# EAGLE design octanis_v0.1 (EAGLE 7.2.0)
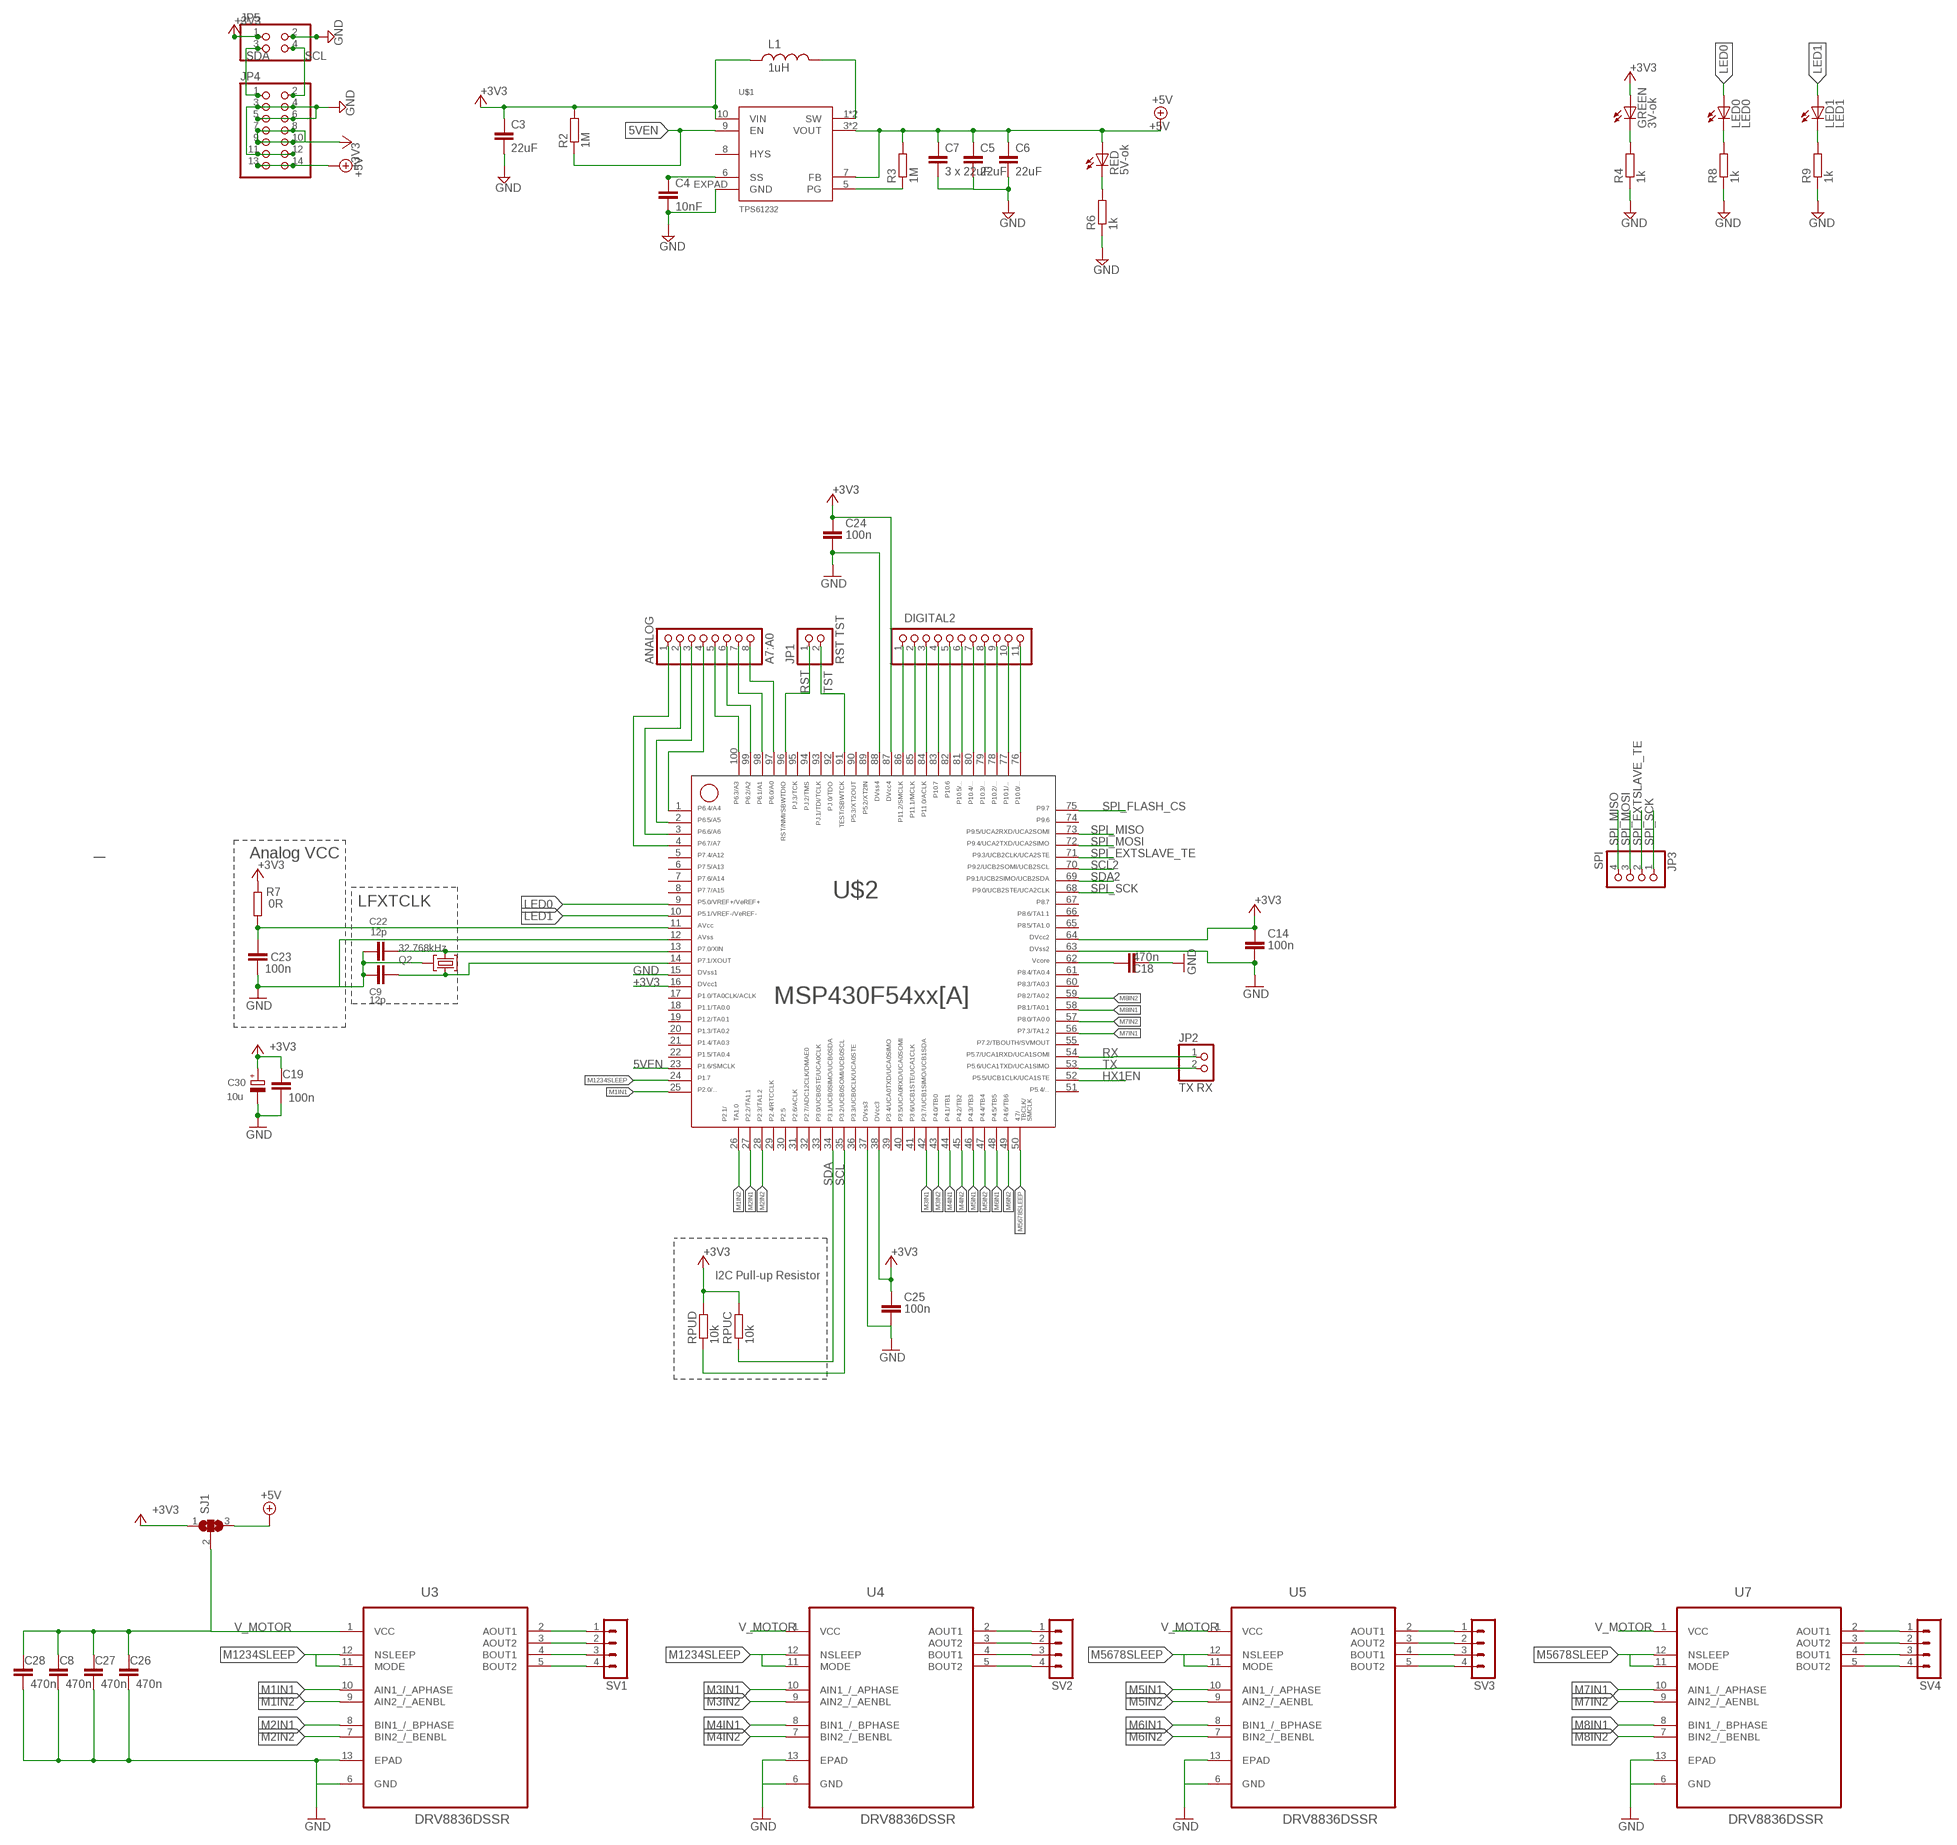
[diagram p0: schematic, sheet 1, part 1 of 2]
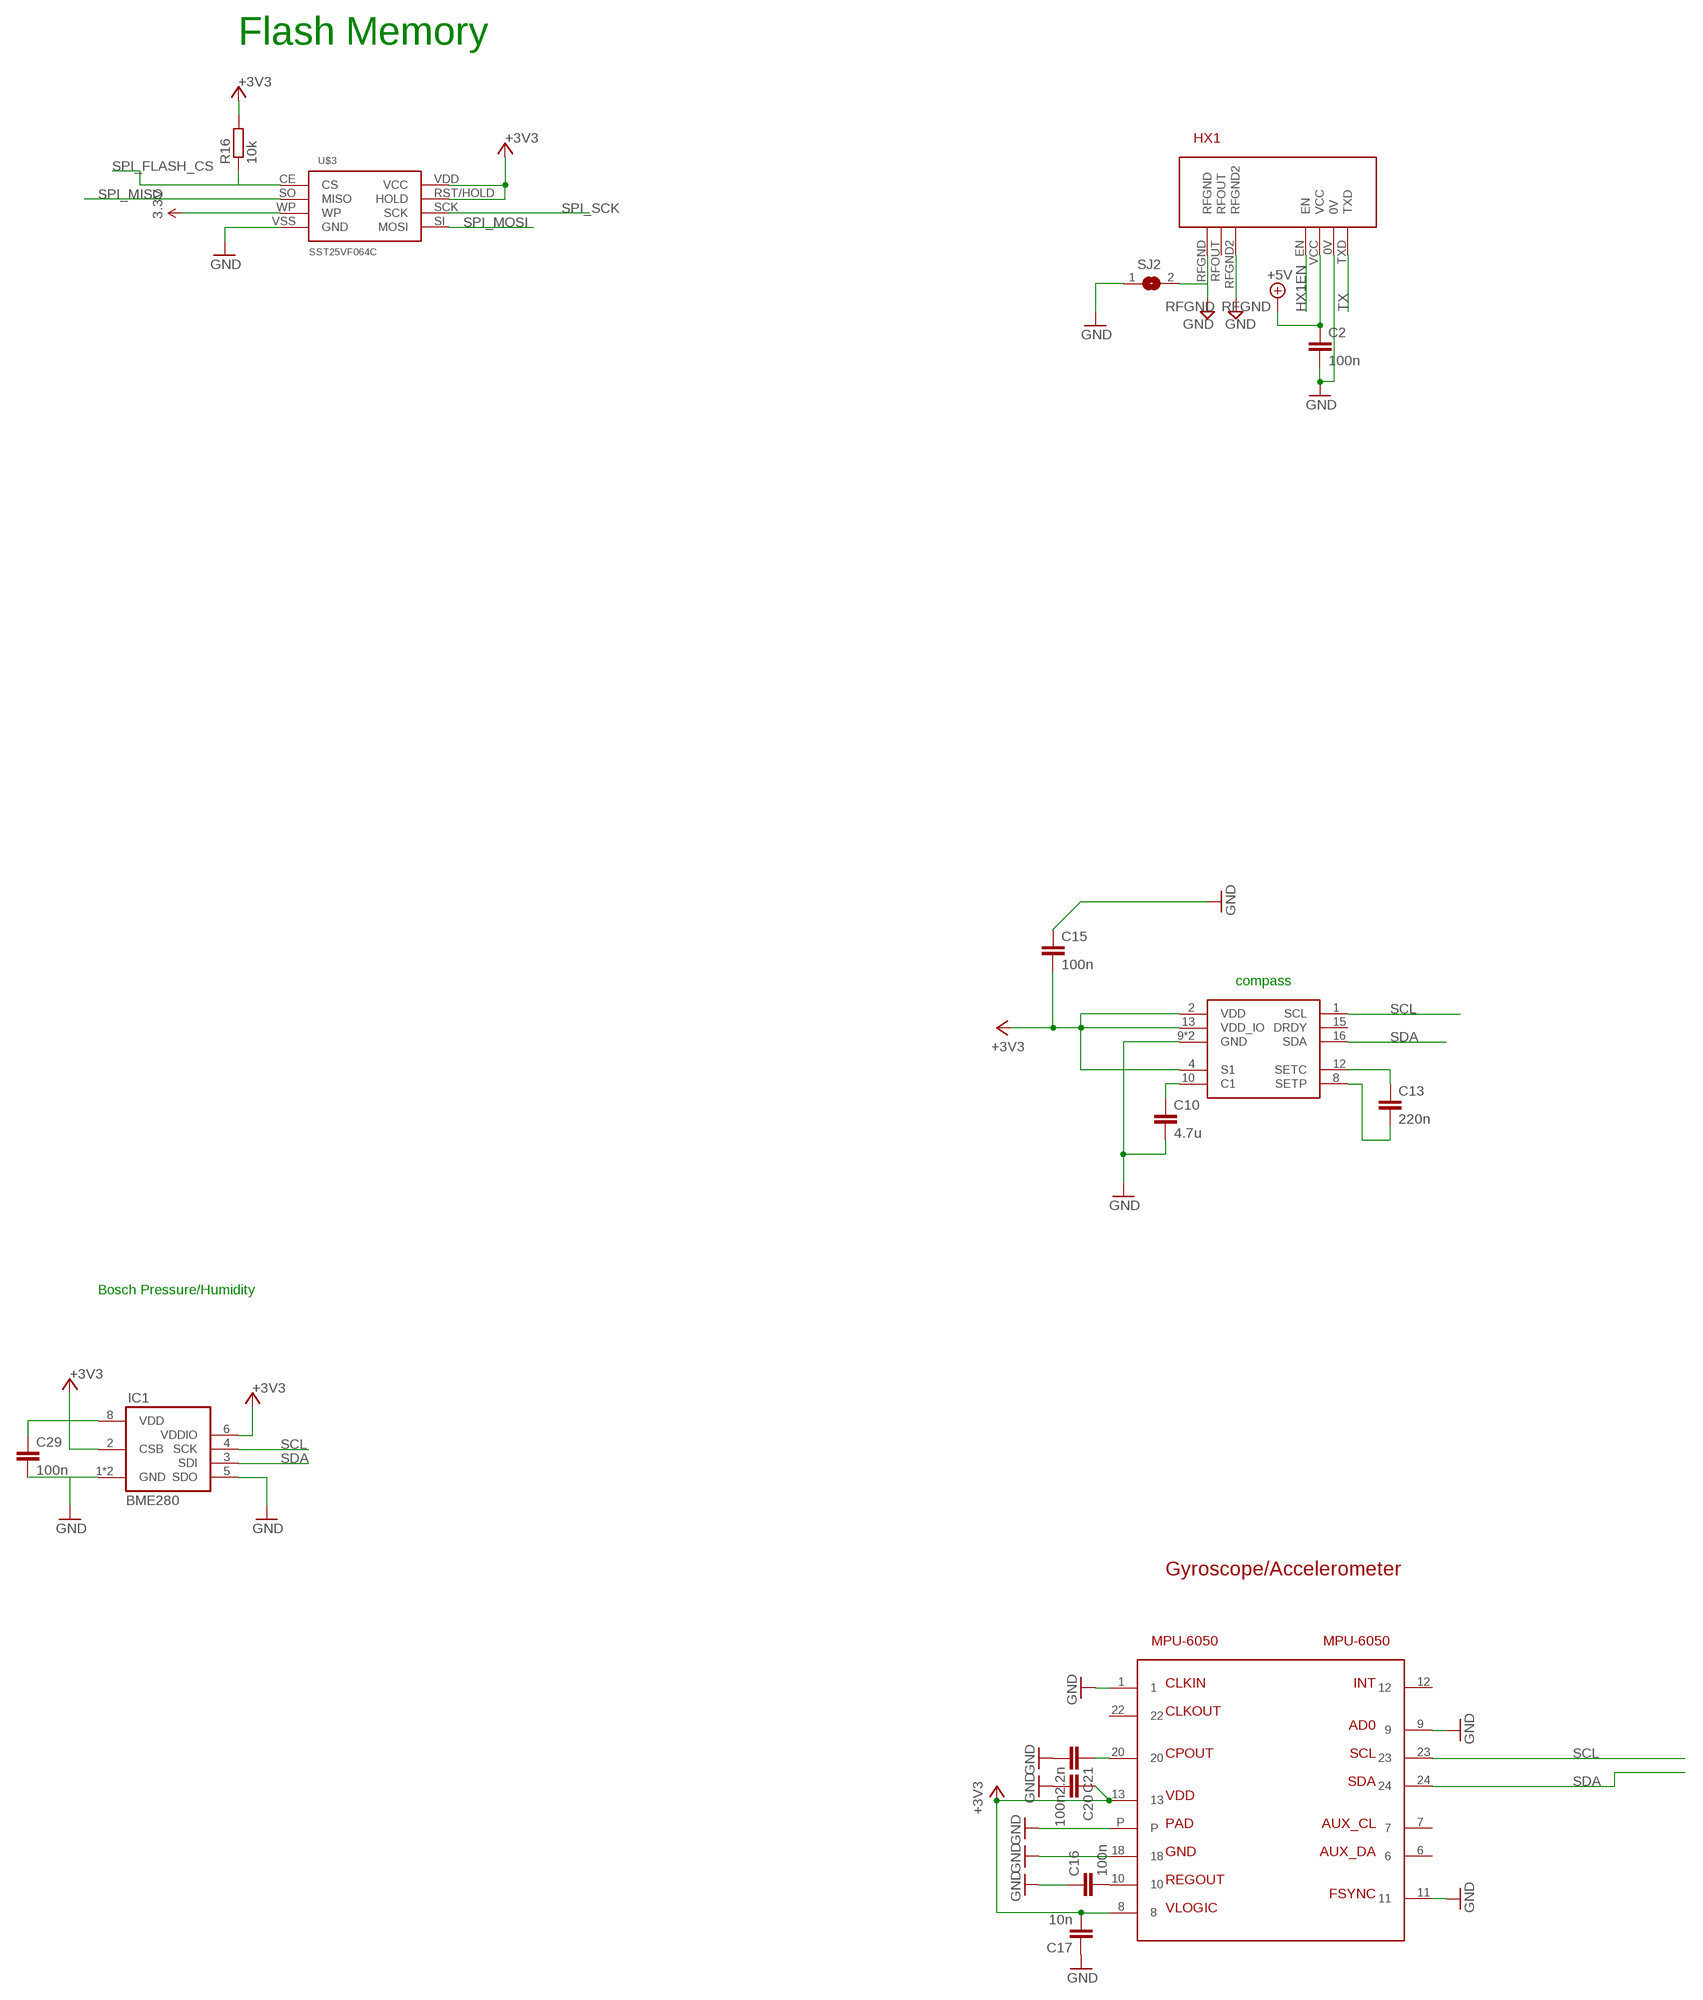
[diagram p1: schematic, sheet 1, part 2 of 2]

## Parts
ANALOG  A7:A0  PINHD-1X8  [1X08]
C2  100n  C-EUC0603  [C0603]
C3  22uF  C-EUC0603  [C0603]
C4  10nF  C-EUC0603  [C0603]
C5  22uF  C-EUC0603  [C0603]
C6  22uF  C-EUC0603  [C0603]
C7  3 x 22uF  C-EUC0603  [C0603]
C8  470n  C-EUC0603  [C0603]
C9  12p  C-EUC0402  [C0402]
C10  4.7u  C-EUC0603  [C0603]
C13  220n  C-EUC0603  [C0603]
C14  100n  C-EUC0603  [C0603]
C15  100n  C-EUC0603  [C0603]
C16  100n  C-EUC0603  [C0603]
C17  10n  C-EUC0603  [C0603]
C18  470n  C-EUC0603  [C0603]
C19  100n  C-EUC0603  [C0603]
C20  100n  C-EUC0603  [C0603]
C21  2.2n  C-EUC0603  [C0603]
C22  12p  C-EUC0402  [C0402]
C23  100n  C-EUC0402  [C0402]
C24  100n  C-EUC0603  [C0603]
C25  100n  C-EUC0603  [C0603]
C26  470n  C-EUC0603  [C0603]
C27  470n  C-EUC0603  [C0603]
C28  470n  C-EUC0603  [C0603]
C29  100n  C-EUC0603  [C0603]
C30  10u  CPOL-EUA/3216-18R  [A/3216-18R]
COMPASS  HMC5883L  HMC5883L  [LPCC16]
DIGITAL2  DIGITAL I/O  PINHD-1X11  [1X11]
GREEN  3V-ok  LEDCHIPLED_0603  [CHIPLED_0603]
IC1  BME280  [BME280]
JP1  RST TST  PINHD-1X2  [1X02]
JP2  TX RX  PINHD-1X2  [1X02]
JP3  SPI  PINHD-1X4  [1X04]
JP4  PINHD-2X7  [2X07]
JP5  PINHD-2X2  [2X02]
L1  1uH  XFL4020  [XFL4020]
LED0  LED0  LEDCHIPLED_0603  [CHIPLED_0603]
LED1  LED1  LEDCHIPLED_0603  [CHIPLED_0603]
MPU-6050  MPU-6050  [QFN24]
Q2  32.768kHz  MS3V-T1R  [MS3V-T1R]
R2  1M  R-EU_R0603  [R0603]
R3  1M  R-EU_R0603  [R0603]
R4  1k  R-EU_R0603  [R0603]
R6  1k  R-EU_R0603  [R0603]
R7  0R  R-EU_R0402  [R0402]
R8  1k  R-EU_R0603  [R0603]
R9  1k  R-EU_R0603  [R0603]
R16  10k  R-EU_R0603  [R0603]
RED  5V-ok  LEDCHIPLED_0603  [CHIPLED_0603]
RPUC  10k  R-EU_R0603  [R0603]
RPUD  10k  R-EU_R0603  [R0603]
SJ1  SJ2W  [SJ_2]
SJ2  SJ  [SJ]
SV1  MA04-1  [MA04-1]
SV2  MA04-1  [MA04-1]
SV3  MA04-1  [MA04-1]
SV4  MA04-1  [MA04-1]
U3  DRV8836DSSR  [SON50P200X300X80-13N]
U4  DRV8836DSSR  [SON50P200X300X80-13N]
U5  DRV8836DSSR  [SON50P200X300X80-13N]
U7  DRV8836DSSR  [SON50P200X300X80-13N]
U$1  TPS61232  [S-PVSON-N10]
U$2  MSP430F5438A  F54XX[A]---PZ100  [PZ100]
U$3  SST25VF064C  [SOIC_8-LEAD]
U$4  HX1  [HX1]

## Nets
3.3V [power]: U$3.WP
5VEN: R2.1 U$1.9(EN) U$2.23
+3V3 [power]: C3.1 C14.1 C15.2 C17.2 C19.2 C20.1 C24.1 C25.1 C29.1 C30.+ COMPASS.2(VDD) COMPASS.4(S1) COMPASS.13(VDD_IO) GREEN.A IC1.2(CSB) IC1.6(VDDIO) IC1.8(VDD) JP4.7 JP4.8 JP4.9 JP4.10 JP5.1 L1.P$1 MPU-6050.8 MPU-6050.13 R2.2 R7.2 R16.2 RPUC.2 RPUD.2 SJ1.1 U$1.10(VIN) U$2.16 U$2.38 U$2.64 U$2.87 U$3.RST/HOLD(HOLD) U$3.VDD(VCC)
+5V [fine]: C2.1 C5.1 C6.1 C7.1 JP4.13 JP4.14 R3.2 RED.A SJ1.3 U$1.3(VOUT) U$1.4(VOUT) U$1.7(FB) U$4.VCC
AVCC1 [VIN]: C23.1 R7.1 U$2.11
GND [power]: C2.2 C3.2 C4.2 C5.2 C6.2 C7.2 C8.1 C9.1 C10.2 C14.2 C15.1 C16.1 C17.1 C18.1 C19.1 C20.2 C21.2 C22.1 C23.2 C24.2 C25.2 C26.1 C27.1 C28.1 C29.2 C30.- COMPASS.9(GND) COMPASS.11(GND) IC1.1(GND) IC1.5(SDO) IC1.7(GND) JP4.3 JP4.4 JP4.5 JP4.6 JP4.11 JP4.12 JP5.2 MPU-6050.1 MPU-6050.9 MPU-6050.11 MPU-6050.18 MPU-6050.P Q2.P3(GND) R4.1 R6.1 R8.1 R9.1 SJ2.1 U3.6(GND) U3.13(EPAD) U4.6(GND) U4.13(EPAD) U5.6(GND) U5.13(EPAD) U7.6(GND) U7.13(EPAD) U$1.EXPAD(GND) U$2.12 U$2.15 U$2.37 U$2.63 U$2.88 U$3.VSS(GND) U$4.0V
HX1EN: U$2.52 U$4.EN
IND: L1.P$2 U$1.1(SW) U$1.2(SW)
LED0: LED0.A U$2.9
LED1: LED1.A U$2.10
M1IN1: U3.10(AIN1_/_APHASE) U$2.25
M1IN2: U3.9(AIN2_/_AENBL) U$2.26
M2IN1: U3.8(BIN1_/_BPHASE) U$2.27
M2IN2: U3.7(BIN2_/_BENBL) U$2.28
M3IN1: U4.10(AIN1_/_APHASE) U$2.42
M3IN2: U4.9(AIN2_/_AENBL) U$2.43
M4IN1: U4.8(BIN1_/_BPHASE) U$2.44
M4IN2: U4.7(BIN2_/_BENBL) U$2.45
M5IN1: U5.10(AIN1_/_APHASE) U$2.46
M5IN2: U5.9(AIN2_/_AENBL) U$2.47
M6IN1: U5.8(BIN1_/_BPHASE) U$2.48
M6IN2: U5.7(BIN2_/_BENBL) U$2.49
M7IN1: U7.10(AIN1_/_APHASE) U$2.56
M7IN2: U7.9(AIN2_/_AENBL) U$2.57
M8IN1: U7.8(BIN1_/_BPHASE) U$2.58
M8IN2: U7.7(BIN2_/_BENBL) U$2.59
M1234SLEEP: U3.11(MODE) U3.12(NSLEEP) U4.11(MODE) U4.12(NSLEEP) U$2.24
M5678SLEEP: U5.11(MODE) U5.12(NSLEEP) U7.11(MODE) U7.12(NSLEEP) U$2.50
N$2: R3.1 U$1.5(PG)
N$4: GREEN.C R4.2
N$5: LED0.C R8.2
N$6: LED1.C R9.2
N$13: SV2.1 U4.2(AOUT1)
N$14: DIGITAL2.1 U$2.86
N$15: DIGITAL2.2 U$2.85
N$17: C10.1 COMPASS.10(C1)
N$18: C16.2 MPU-6050.10
N$19: C21.1 MPU-6050.20
N$20: DIGITAL2.3 U$2.84
N$21: DIGITAL2.4 U$2.83
N$22: DIGITAL2.5 U$2.82
N$23: DIGITAL2.6 U$2.81
N$24: DIGITAL2.7 U$2.80
N$25: C13.2 COMPASS.8(SETP)
N$26: DIGITAL2.8 U$2.79
N$27: ANALOG.8 U$2.97
N$28: ANALOG.7 U$2.98
N$30: ANALOG.6 U$2.99
N$31: DIGITAL2.9 U$2.78
N$32: C13.1 COMPASS.12(SETC)
N$39: SV2.2 U4.3(AOUT2)
N$40: SV2.3 U4.4(BOUT1)
N$41: SV2.4 U4.5(BOUT2)
N$42: C4.1 U$1.6(SS)
N$44: R6.2 RED.C
N$45: SV3.1 U5.2(AOUT1)
N$46: SV3.2 U5.3(AOUT2)
N$47: SV3.3 U5.4(BOUT1)
N$48: SV3.4 U5.5(BOUT2)
N$49: SV1.1 U3.2(AOUT1)
N$50: SV1.2 U3.3(AOUT2)
N$51: SV1.3 U3.4(BOUT1)
N$52: SV1.4 U3.5(BOUT2)
N$53: SV4.1 U7.2(AOUT1)
N$54: SV4.2 U7.3(AOUT2)
N$55: SV4.3 U7.4(BOUT1)
N$56: SV4.4 U7.5(BOUT2)
N$73: ANALOG.5 U$2.100
N$74: ANALOG.4 U$2.1
N$75: ANALOG.3 U$2.2
N$76: ANALOG.2 U$2.3
N$77: ANALOG.1 U$2.4
N$78: DIGITAL2.10 U$2.77
N$79: DIGITAL2.11 U$2.76
P5.4/XIN1: C22.2 Q2.P2 U$2.13
P5.5/XOUT1: C9.2 Q2.P1 U$2.14
RFGND [power]: SJ2.2 U$4.RFGND U$4.RFGND2 ; supply symbol labelled GND
RST: JP1.1 U$2.96
RX: JP2.1 U$2.54
SCL: COMPASS.1(SCL) IC1.4(SCK) JP4.2 JP5.4 MPU-6050.23 RPUD.1 U$2.35
SCL2: U$2.70
SDA: COMPASS.16(SDA) IC1.3(SDI) JP4.1 JP5.3 MPU-6050.24 RPUC.1 U$2.34
SDA2: U$2.69
SPI_EXTSLAVE_TE: JP3.2 U$2.71
SPI_FLASH_CS: R16.1 U$2.75 U$3.CE(CS)
SPI_MISO: JP3.4 U$2.73 U$3.SO(MISO)
SPI_MOSI: JP3.3 U$2.72 U$3.SI(MOSI)
SPI_SCK: JP3.1 U$2.68 U$3.SCK
TST: JP1.2 U$2.91
TX: JP2.2 U$2.53 U$4.TXD
V_MOTOR [fine]: C8.2 C26.2 C27.2 C28.2 SJ1.2 U3.1(VCC) U4.1(VCC) U5.1(VCC) U7.1(VCC)
VCORE [VIN]: C18.2 U$2.62
Unconnected: COMPASS.15(DRDY) MPU-6050.6 MPU-6050.7 MPU-6050.12 MPU-6050.22 U$1.8(HYS) U$2.5 U$2.6 U$2.7 U$2.8 U$2.17 U$2.18 U$2.19 U$2.20 U$2.21 U$2.22 U$2.29 U$2.30 U$2.31 U$2.32 U$2.33 U$2.36 U$2.39 U$2.40 U$2.41 U$2.51 U$2.55 U$2.60 U$2.61 U$2.65 U$2.66 U$2.67 U$2.74 U$2.89 U$2.90 U$2.92 U$2.93 U$2.94 U$2.95 U$4.RFOUT

## Notes on the sheet
- Flash Memory
- compass
- Analog VCC
- LFXTCLK
- Bosch Pressure/Humidity
- I2C Pull-up Resistor
- Gyroscope/Accelerometer

## Library data of the parts
ANALOG = pinhead:PINHD-1X8: PIN HEADER
C2-C10 C13-C29 = rcl:C-EU: CAPACITOR, European symbol
C30 = rcl:CPOL-EU: POLARIZED CAPACITOR, European symbol
COMPASS = HMC5883L:HMC5883L
DIGITAL2 = pinhead:PINHD-1X11: PIN HEADER
GREEN LED0 LED1 RED = adafruit:LED: LED OSRAM: - CHIPLED LG R971, LG N971, LY N971, LG Q971, LY Q971, LO R971, LY R971 LH N974, LH R974 LS Q976, LO Q976, LY Q976 LO Q996 - Hyper CHIPLED LW Q18S LB Q993, LB Q99A, LB R99A - SideLED LS A670, LO A670, LY A670, LG A670, LP A670 LB A673, LV A673, LT A673, LW A673 LH A674 LY A675 LS A676, LA A676, LO A676, LY A676, LW A676 LS A679, LY A679, LG A679 - Hyper Micro SIDELED® LS Y876, LA Y876, LO Y876, LY Y876 LT Y87S - SmartLED LW L88C, LW L88S LB L89C, LB L89S, LG L890 LS L89K, LO L89K, LY L89K LS L896, LA L896, LO L896, LY L896 - TOPLED LS T670, LO T670, LY T670, LG T670, LP T670 LSG T670, LSP T670, LSY T670, LOP T670, LYG T670 LG T671, LOG T671, LSG T671 LB T673, LV T673, LT T673, LW T673 LH T674 LS T676, LA T676, LO T676, LY T676, LB T676, LH T676, LSB T676, LW T676 LB T67C, LV T67C, LT T67C, LS T67K, LO T67K, LY T67K, LW E67C LS E67B, LA E67B, LO E67B, LY E67B, LB E67C, LV E67C, LT E67C LW T67C LS T679, LY T679, LG T679 LS T770, LO T770, LY T770, LG T770, LP T770 LB T773, LV T773, LT T773, LW T773 LH T774 LS E675, LA E675, LY E675, LS T675 LS T776, LA T776, LO T776, LY T776, LB T776 LHGB T686 LT T68C, LB T68C - Hyper Mini TOPLED® LB M676 - Mini TOPLED Santana® LG M470 LS M47K, LO M47K, LY M47K Source: http://www.osram.convergy.de/
IC1 = bosch-bme280:BME280: DIGITAL HUMIDITY, PRESSURE AND TEMPERATURE SENSOR * Digital interface I²C (up to 3.4 MHz) and SPI (3 and 4 wire, up to 10 MHz)* Supply voltage VDD main supply voltage range: 1.71 V to 3.6 V*VDDIO interface voltage range: 1.2 V to 3.6 V Operating range -40…+85 °C, 0…100 % rel. humidity, 300…1100 hPa The library has been designed by Richard Magdycz <https://www.facebook.com/groups/eaglecadsoftUK>
JP1 JP2 = pinhead:PINHD-1X2: PIN HEADER
JP3 = pinhead:PINHD-1X4: PIN HEADER
JP4 = pinhead:PINHD-2X7: PIN HEADER
JP5 = pinhead:PINHD-2X2: PIN HEADER
L1 = Coilcraft:XFL4020
MPU-6050 = seb:MPU-6050
Q2 = microcrystal:MS3V-T1R
R2-R4 R6-R9 R16 RPUC RPUD = rcl:R-EU_: RESISTOR, European symbol
SJ1 = jumper:SJ2W: SMD solder JUMPER
SJ2 = jumper:SJ: SMD solder JUMPER
SV1-SV4 = con-lstb:MA04-1: PIN HEADER; OC_FARNELL: unknown; OC_NEWARK: unknown
U3-U5 U7 = DRV8834:DRV8836DSSR: DUAL LOW VOLTAGE H-BRIDGE IC,SON-12; MPN: DRV8836DSSR; OC_FARNELL: 2115236; OC_NEWARK: 94T6066; PACKAGE: SON-12; SUPPLIER: TEXAS INSTRUMENTS
U$1 = texasinstruments:TPS61232: Up to 96% Efficiency Synchronous Boost Converter 3.3 V to 5 V Power Conversion with 2.1 A Output Current Input Supply Voltage Supervisor with Adjustable Threshold/ Hysteresis Power Save Mode for Light Load Efficiency Load Disconnect During Shutdown Output Over Voltage Protection Programmable Soft Start Power Good Output Input Voltage Range: 2.3 V to 5.5 V Output Voltage Range: 2.5 V to 5.5 V 2 MHz Switching Frequency Output Capacitor Discharge (TPS61231) 3 mm × 3 mm × 0.9 mm SON Package
U$2 = TI_MSP430_v16:F54XX[A]---PZ100: ***MSP430F54xx***PZ100
U$3 = BertaLib:SST25VF064C
U$4 = Octanis1:HX1: Radiometrix HX1: VHF Narrow Band FM 300mW Transmitter. HX1-144.390-3

## Net classes
0 default: width 0.305 mm
1 power: width 0.203 mm, drill 0.305 mm, clearance 0.152 mm
2 VIN: width 0.203 mm, drill 0.305 mm, clearance 0.152 mm
3 fine: width 0.406 mm, drill 0.61 mm, clearance 0.152 mm

## Board
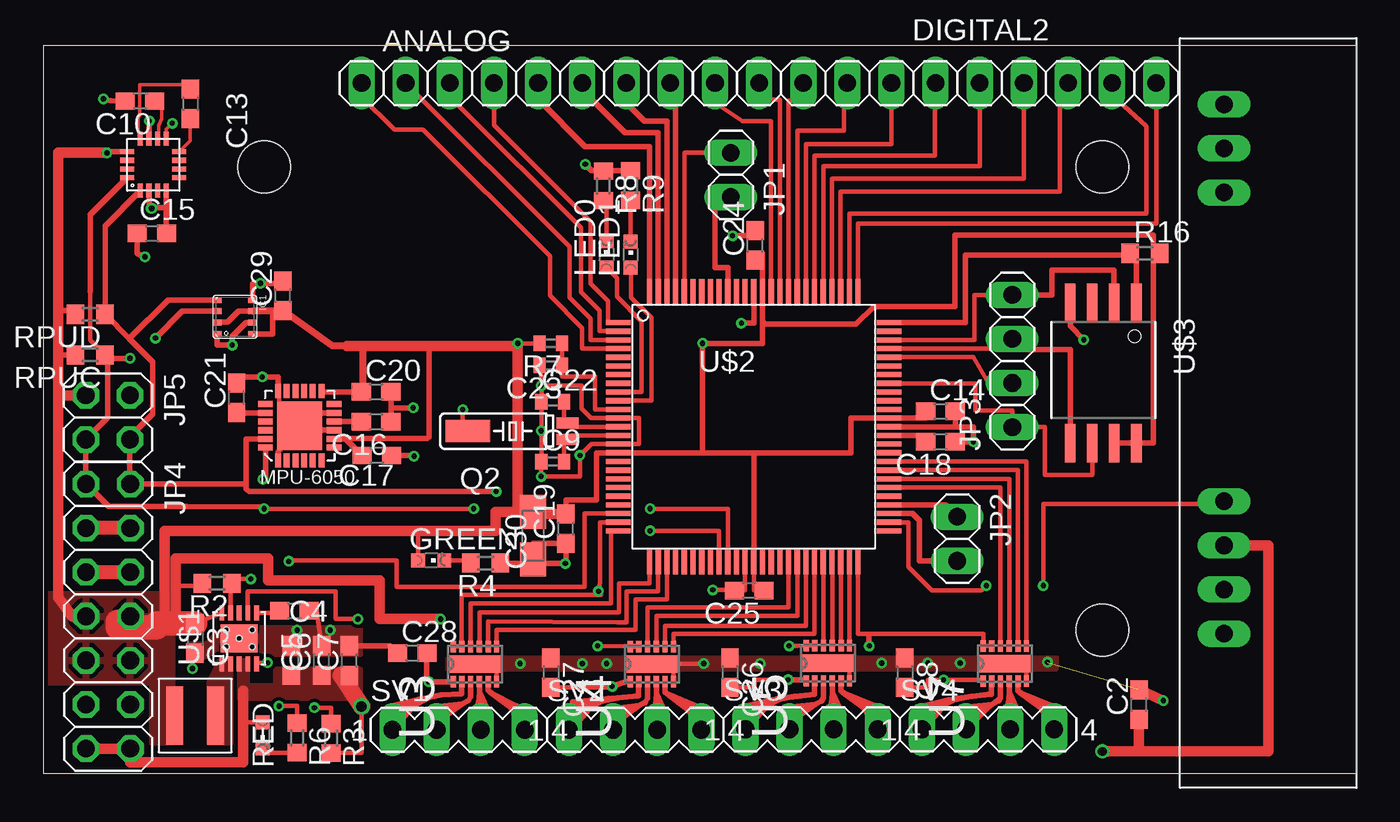
[diagram p2: board, top side]
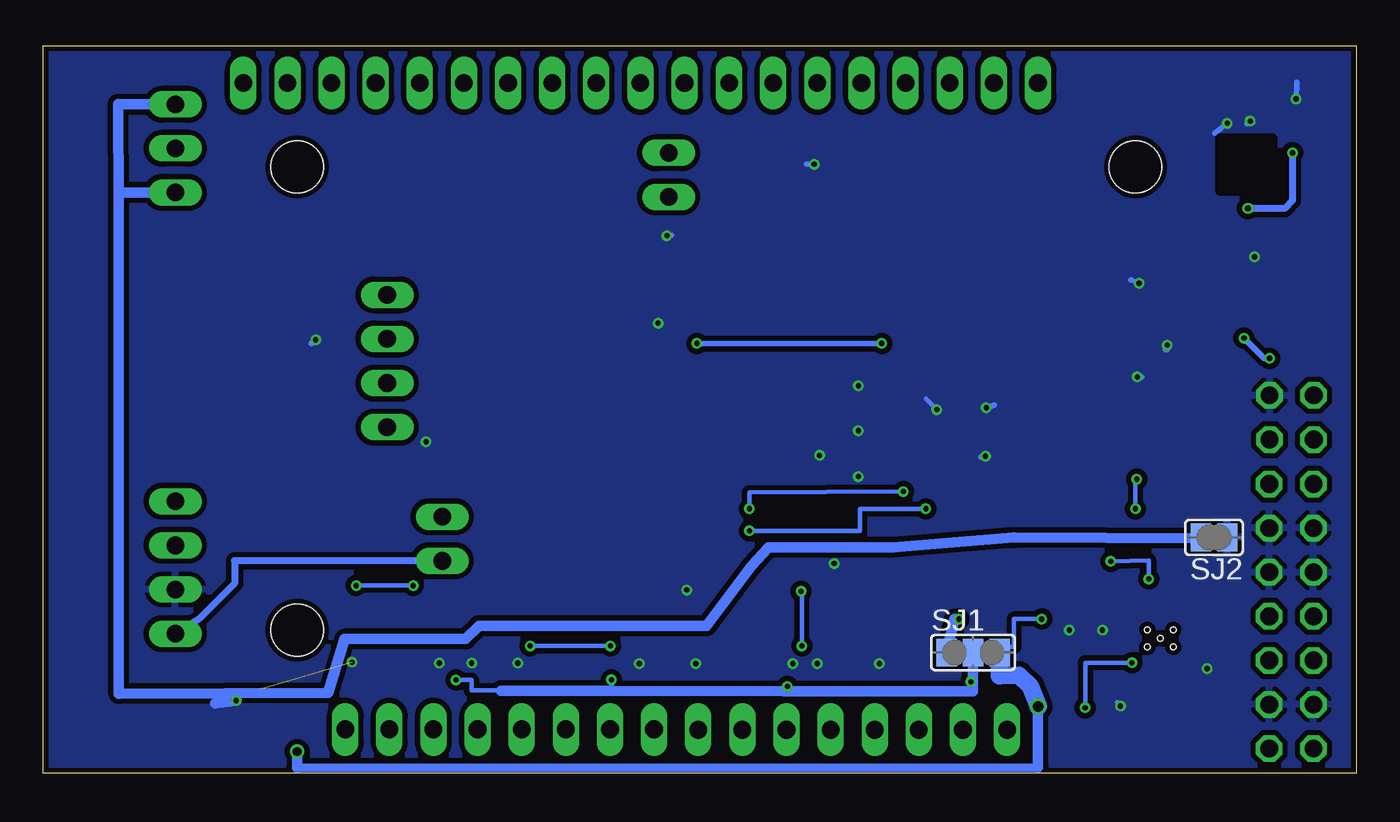
[diagram p3: board, bottom side, seen from below]

Size 75.56 x 41.91 mm. Coordinates in mm from the lower left corner, seen from the top.
Outline: 0,0 75.56,0 75.56,41.91 0,41.91 0,0
Copper layers (1*16): Top 0.035mm / dielectric 1.5mm / Bottom 0.035mm
Design rules "SeeedStudio_2layer_DRU_no_angle_20140221 *": minimum track width 8mil, minimum drill 12mil, track to track 8mil, track to pad 8mil, pad to pad 6mil, via to via 8mil, smd to smd 0mil, copper to edge 10mil, drill to drill 10mil, minimum pad ring 10mil, minimum via ring 6mil, stop-mask expansion 2mil, vias tented up to drill 100mil, thermal gap 10mil
Holes 3 mm at 12.7,34.92 60.96,34.92 60.96,8.26
bRestrict: area 4.8,33.6 to 7.8,36.6

### Footprints (pad centres in the part's own frame; a part is rotated, then mirrored left to right if it is on the bottom)
1X08 = drill 1.016 long: 1 -8.89,0; 2 -6.35,0; 3 -3.81,0; 4 -1.27,0; 5 1.27,0; 6 3.81,0; 7 6.35,0; 8 8.89,0
C0603 = smd 1.1 x 1: 1 -0.85,0; 2 0.85,0
C0402 = smd 0.7 x 0.9: 1 -0.65,0; 2 0.65,0
A/3216-18R = smd 1.95 x 1.5: + 1.375,0; - -1.375,0
LPCC16 = smd 0.8 x 0.3: 1 -1.5,0.75; 2 -1.5,0.25; 3 -1.5,-0.25; 4 -1.5,-0.75; 9 1.5,-0.75; 10 1.5,-0.25; 11 1.5,0.25; 12 1.5,0.75 | smd 0.3 x 0.8: 5 -0.75,-1.5; 6 -0.25,-1.5; 7 0.25,-1.5; 8 0.75,-1.5; 13 0.75,1.5; 14 0.25,1.5; 15 -0.25,1.5; 16 -0.75,1.5
1X11 = drill 1.016 long: 1 -12.7,0; 2 -10.16,0; 3 -7.62,0; 4 -5.08,0; 5 -2.54,0; 6 0,0; 7 2.54,0; 8 5.08,0; 9 7.62,0; 10 10.16,0; 11 12.7,0
CHIPLED_0603 = smd 0.8 x 0.8: A 0,-0.75; C 0,0.75
BME280 = smd 0.35 x 0.5: 1 0.975,-1.025; 2 0.325,-1.025; 3 -0.325,-1.025; 4 -0.975,-1.025; 5 -0.975,1.025; 6 -0.325,1.025; 7 0.325,1.025; 8 0.975,1.025
1X02 = drill 1.016 long: 1 -1.27,0; 2 1.27,0
1X04 = drill 1.016 long: 1 -3.81,0; 2 -1.27,0; 3 1.27,0; 4 3.81,0
2X07 = drill 1.016 octagon: 1 -7.62,-1.27; 2 -7.62,1.27; 3 -5.08,-1.27; 4 -5.08,1.27; 5 -2.54,-1.27; 6 -2.54,1.27; 7 0,-1.27; 8 0,1.27; 9 2.54,-1.27; 10 2.54,1.27; 11 5.08,-1.27; 12 5.08,1.27; 13 7.62,-1.27; 14 7.62,1.27
2X02 = drill 1.016 octagon: 1 -1.27,-1.27; 2 -1.27,1.27; 3 1.27,-1.27; 4 1.27,1.27
XFL4020 = smd 0.965 x 3.353: P$1 -1.181,0; P$2 1.181,0
QFN24 = smd 0.8 x 0.35: 1 -2,1.25; 2 -2,0.75; 3 -2,0.25; 4 -2,-0.25; 5 -2,-0.75; 6 -2,-1.25; 13 2,-1.25; 14 2,-0.75; 15 2,-0.25; 16 2,0.25; 17 2,0.75; 18 2,1.25 | smd 0.35 x 0.85: 7 -1.25,-1.975; 8 -0.75,-1.975; 9 -0.25,-1.975; 10 0.25,-1.975; 11 0.75,-1.975; 12 1.25,-1.975; 19 1.25,1.975; 20 0.75,1.975; 21 0.25,1.975; 22 -0.25,1.975; 23 -0.75,1.975; 24 -1.25,1.975 | smd 2.8 x 2.6: P 0,0
MS3V-T1R = smd 0.635 x 1.27: P1 -0.47,-4.43; P2 0.47,-4.43 | smd 1.27 x 2.54: P3 0,1.3
R0603 = smd 1 x 1.1: 1 -0.85,0; 2 0.85,0
R0402 = smd 0.7 x 0.9: 1 -0.65,0; 2 0.65,0
SJ_2 = smd 1.168 x 1.6: 1 -1.524,0; 2 0,0; 3 1.524,0
SJ = smd 1.168 x 1.6: 1 -0.762,0; 2 0.762,0
MA04-1 = drill 1.016 long: 1 -3.81,0; 2 -1.27,0; 3 1.27,0; 4 3.81,0
SON50P200X300X80-13N = smd 0.66 x 0.305: 1 -1.016,1.245; 2 -1.016,0.762; 3 -1.016,0.254; 4 -1.016,-0.254; 5 -1.016,-0.762; 6 -1.016,-1.245; 7 1.016,-1.245; 8 1.016,-0.762; 9 1.016,-0.254; 10 1.016,0.254; 11 1.016,0.762; 12 1.016,1.245 | smd 0.991 x 3.099: 13 0,0
S-PVSON-N10 = smd 0.28 x 0.825: 1 -1,-1.462; 2 -0.5,-1.462; 3 0,-1.462; 4 0.5,-1.462; 5 1,-1.462; 6 1,1.462; 7 0.5,1.462; 8 0,1.462; 9 -0.5,1.462; 10 -1,1.462 | smd 2.15 x 1.6: EXPAD 0,0 | hole 0.3: -0.75,0.5; 0.75,0.5; 0.75,-0.5; -0.75,-0.5; 0,0
PZ100 = smd 1.4 x 0.3: 1 -7.8,6; 2 -7.8,5.5; 3 -7.8,5; 4 -7.8,4.5; 5 -7.8,4; 6 -7.8,3.5; 7 -7.8,3; 8 -7.8,2.5; 9 -7.8,2; 10 -7.8,1.5; 11 -7.8,1; 12 -7.8,0.5; 13 -7.8,0; 14 -7.8,-0.5; 15 -7.8,-1; 16 -7.8,-1.5; 17 -7.8,-2; 18 -7.8,-2.5; 19 -7.8,-3; 20 -7.8,-3.5; 21 -7.8,-4; 22 -7.8,-4.5; 23 -7.8,-5; 24 -7.8,-5.5; 25 -7.8,-6; 51 7.8,-6; 52 7.8,-5.5; 53 7.8,-5; 54 7.8,-4.5; 55 7.8,-4; 56 7.8,-3.5; 57 7.8,-3; 58 7.8,-2.5; 59 7.8,-2; 60 7.8,-1.5; 61 7.8,-1; 62 7.8,-0.5; 63 7.8,0; 64 7.8,0.5; 65 7.8,1; 66 7.8,1.5; 67 7.8,2; 68 7.8,2.5; 69 7.8,3; 70 7.8,3.5; 71 7.8,4; 72 7.8,4.5; 73 7.8,5; 74 7.8,5.5; 75 7.8,6 | smd 0.3 x 1.4: 26 -6,-7.8; 27 -5.5,-7.8; 28 -5,-7.8; 29 -4.5,-7.8; 30 -4,-7.8; 31 -3.5,-7.8; 32 -3,-7.8; 33 -2.5,-7.8; 34 -2,-7.8; 35 -1.5,-7.8; 36 -1,-7.8; 37 -0.5,-7.8; 38 0,-7.8; 39 0.5,-7.8; 40 1,-7.8; 41 1.5,-7.8; 42 2,-7.8; 43 2.5,-7.8; 44 3,-7.8; 45 3.5,-7.8; 46 4,-7.8; 47 4.5,-7.8; 48 5,-7.8; 49 5.5,-7.8; 50 6,-7.8; 76 6,7.8; 77 5.5,7.8; 78 5,7.8; 79 4.5,7.8; 80 4,7.8; 81 3.5,7.8; 82 3,7.8; 83 2.5,7.8; 84 2,7.8; 85 1.5,7.8; 86 1,7.8; 87 0.5,7.8; 88 0,7.8; 89 -0.5,7.8; 90 -1,7.8; 91 -1.5,7.8; 92 -2,7.8; 93 -2.5,7.8; 94 -3,7.8; 95 -3.5,7.8; 96 -4,7.8; 97 -4.5,7.8; 98 -5,7.8; 99 -5.5,7.8; 100 -6,7.8
SOIC_8-LEAD = smd 0.61 x 2.21: CE -1.905,-2.934; RST/HOLD -0.635,5.156; SCK 0.635,5.156; SI 1.905,5.156; SO -0.635,-2.934; VDD -1.905,5.156; VSS 1.905,-2.934; WP 0.635,-2.934
HX1 = drill 1.016 long: 0V 13.97,0; EN 8.89,0; RFGND -13.97,0; RFGND2 -8.89,0; RFOUT -11.43,0; TXD 16.51,0; VCC 11.43,0

### Placement (x,y rotation side)
ANALOG  27.2,39.75 0 top
C2  63.07,3.96 90 top
C3  8.73,7.78 270 top
C4  14.45,9.37 0 top
C5  14.27,6.51 90 top
C6  16.02,6.51 90 top
C7  17.62,6.51 90 top
C8  49.58,5.82 270 top
C9  29.31,17.96 0 top
C10  5.56,38.71 180 top
C13  8.46,38.56 270 top
C14  51.64,20.85 0 top
C15  6.25,31.09 0 top
C16  19.15,20.24 180 top
C17  19.2,18.31 180 top
C18  51.64,19.1 180 top
C19  30.07,14.1 90 top
C20  19.15,21.97 0 top
C21  11.13,21.64 90 top
C22  29.31,21.41 0 top
C23  29.21,23.5 180 top
C24  40.97,30.4 90 top
C25  40.63,10.53 180 top
C26  39.52,5.82 270 top
C27  29.21,5.82 270 top
C28  21.23,6.93 0 top
C29  13.79,27.51 90 top
C30  28.19,13.69 90 top
COMPASS  6.32,35.05 90 top
DIGITAL2  51.36,39.75 0 top
GREEN  22.33,12.27 270 top
IC1  11.02,26.29 270 top
JP1  39.57,34.47 270 top
JP2  52.6,13.51 270 top
JP3  55.78,23.75 90 top
JP4  3.73,9.05 270 top
JP5  3.71,20.5 270 top
L1  8.73,3.33 0 top
LED0  32.41,29.9 0 top
LED1  33.81,29.87 0 top
MPU-6050  14.76,20.02 90 top
Q2  25.73,19.71 90 top
R2  10,10.95 180 top
R3  16.56,2.03 270 top
R4  25.45,12.12 180 top
R6  14.61,2.05 270 top
R7  29.21,24.77 180 top
R8  32.23,33.83 270 top
R9  33.81,33.86 270 top
R16  63.4,29.95 0 top
RED  12.62,2.2 180 top
RPUC  2.69,24.1 180 top
RPUD  2.69,26.44 180 top
SJ1  22.05,6.96 0 bottom
SJ2  8.18,13.59 180 bottom
SV1  23.9,2.51 0 top
SV2  34.06,2.51 0 top
SV3  44.22,2.54 0 top
SV4  54.38,2.54 0 top
U3  24.84,6.3 90 top
U4  35.03,6.3 90 top
U5  45.16,6.35 90 top
U7  55.35,6.32 90 top
U$1  11.27,7.78 0 top
U$2  40.89,19.96 0 top
U$3  61.01,24.18 180 top
U$4  67.97,24.56 270 top

### Tracks (layer width: path | path; a pad name or v marks a point on that pad's centre or on a via)
5VEN  (via drill 0.3)
  Top 0.254: U$1.9 10.77,10.95 R2.1 10.85,11.2 v11.94,11.2 | v14.12,12.22 14.22,12.27 20.32,12.27 20.32,10.74 31.14,10.74 31.14,14.96 U$2.23
  Bottom 0.254: v14.12,12.22 11.94,12.27 v11.94,11.2
+3V3  (via drill 0.3)
  Top 0.254: C3.1 U$1.10 | R2.2 9.15,10.79 7.62,10.79 | U$2.38 40.89,10.53 C25.1 | 28.19,14.95 C30.+ | R7.2 v27.3,24.77 | GREEN.A 21.58,13.93 21.54,13.97
  Top 0.305: 40.89,18.46 U$2.16 31.85,18.46 31.85,15.75 30.07,15.75 C19.2 | 40.89,18.46 U$2.38 | C14.1 50.79,20.46 U$2.64 46.48,20.46 46.48,18.47 40.89,18.47 40.89,18.46 | 41.39,26.04 U$2.87 41.39,29.92 C24.1 | 41.39,26.04 41.39,24.77 v37.95,24.77 37.95,18.47 35.15,18.47 | U$3.RST/HOLD U$3.VDD 63.91,19.03 63.91,30.1 | 41.39,26.04 41.55,25.88 46.79,25.88 47.8,26.9 52.48,26.9 52.48,31.01 63.91,31.01 63.91,30.1 | MPU-6050.13 16.05,21.97 C20.1 | C17.2 17.4,19.27 MPU-6050.8 16.75,19.28 22.1,19.28 22.2,19.38 22.2,24.62 | R16.2 64.06,29.95 63.91,30.1 | COMPASS.4 7.08,32.59 | 7.08,32.59 7.08,31.11 C15.2 | COMPASS.2 6.08,32.71 v6.25,32.54 | v3.66,35.74 3.66,35.8 COMPASS.13 | v6.2,32.54 6.2,32.59 7.08,32.59 | 1.83,26.44 RPUD.2 1.64,26.65 0.86,26.65 | RPUC.2 1.84,24.5 1.45,24.11 0.86,24.11 | IC1.6 11.25,26.61 10.62,25.98 10.02,25.98 IC1.2 | IC1.8 13.21,25.31 13.21,26.61
  Top 0.406: 17.48,24.62 16.64,24.62 C29.1 13.54,26.61 13.21,26.61 IC1.6 | C20.1 18.39,22.06 18.39,24.62
  Top 0.61: v22.86,8.89 19.37,8.89 19.37,11.11 12.94,11.11 12.94,12.38 7.62,12.38 7.62,10.79 7.62,8.63 6.99,8.63 | 6.35,8.89 6.99,8.89 6.99,13.97 21.54,13.97 26.04,13.97 26.04,15.07 27.3,15.07 | 27.3,15.07 C30.+ | 27.3,15.07 v27.3,24.77 27.16,24.62 22.2,24.62 18.39,24.62 17.48,24.62 | 28.19,14.95 C19.2 | 0.86,21.67 0.86,10.13 1.65,9.05 JP4.7 | 0.86,21.67 0.86,24.11 0.86,26.65 0.86,35.74 v3.66,35.74 | JP5.1 0.96,21.77 0.86,21.67
  Top 1.422: C3.1 6.99,8.63 6.51,8.63 6.51,8.41 4.29,8.41 4.29,8.73
  Bottom 0.305: v37.95,24.77 v27.3,24.77 | v6.25,32.54 v6.2,32.54
  Bottom 0.406: v3.66,35.74 3.66,32.99 4.12,32.54 v6.25,32.54
  Bottom 0.61: SJ1.1 23.11,8.89 v22.86,8.89
  pour Top: -0.16,10.32 7.46,10.32 6.19,5.24 -0.16,5.24
  pour Top (no thermals): 7.46,1.75 7.46,9.05 6.19,9.05 6.19,1.75
+5V  (via drill 0.3, 0.5, 0.6)
  Top 0.254: U$1.7 11.77,10.48 16.83,10.48 16.83,8.89 v18.1,8.89 | R3.2 18.31,1.18 v18.31,3.86 | 11.49,1.37 11.54,2.95 RED.A
  Top 0.61: JP4.13 JP4.14 5,0.64 11.49,0.64 11.49,1.37 11.49,4.76 | U$4.VCC 70.51,13.13 70.51,1.27 63.07,1.27 | 63.07,1.27 v60.96,1.27 | C2.1 63.07,1.27
  Top 1.016: v18.31,3.86 17.14,5.66 C7.1
  Bottom 0.254: v18.1,8.89 19.68,8.89 19.68,7.3 20.07,7.3 SJ1.3
  Bottom 0.508: 60.96,0.32 18.31,0.37
  Bottom 0.61: 18.74,5.03 19.56,5.44 | v60.96,1.27 60.96,0.32 | 18.31,0.37 v18.31,3.86
  Bottom 1.016: SJ1.3 20.52,5.63 19.4,5.66 18.74,5.03 18.28,3.86 v18.31,3.86
  pour Top (no thermals): 18.26,6.03 13.34,6.03 13.34,5.08 11.75,5.08 11.75,6.51 11.27,6.51 11.27,4.29 18.26,4.29
AVCC1
  Top 0.254: U$2.11 31.75,20.96 31.75,22.86 29.86,22.86 C23.1 R7.1
GND  (via drill 0.3)  (1 unrouted)
  Top 0.203: 56.62,5.36 U7.6 | 26.06,6.25 24.84,6.25 U3.13 | 46.33,6.27 45.26,6.27 U5.13 | 55.4,6.27 U7.13 | COMPASS.9 7.08,37.1 v7.42,37.44
  Top 0.254: v38.01,6.33 36.42,6.33 arc90 36.27,6.17 U4.6 | U5.6 46.41,6.2 arc90 46.33,6.27 | U7.6 56.59,6.34 arc-90 56.6,6.35 55.37,6.35 arc90 U7.13 | U3.6 26.09,6.22 arc90 26.06,6.25 | C4.2 15.72,9.37 C6.2 | v8.57,6.03 8.57,6.98 | 40.39,12.57 U$2.37 40.39,10.53 C25.2 39.78,10.57 v38.53,10.57 | U$2.15 31.55,18.96 31.55,18.97 v30.89,18.31 30.89,17.09 v28.65,17.09 C9.1 C22.1 28.66,22.33 30.99,22.33 30.99,21.01 31.53,20.46 U$2.12 34.29,20.46 34.29,18.97 32.72,18.97 | C23.2 28.65,23.5 v28.65,22.33 | Q2.P3 24.13,20.01 v24.13,20.96 | R6.1 14.61,3.89 v13.56,3.89 | R4.1 27.99,12.12 C30.- | 13.51,18.51 13.77,18.77 | MPU-6050.18 13.56,21.41 13.87,21.21
  Top 0.305: C30.- 28.19,13.25 C19.1 30.07,12.09 v30.05,12.09 28.22,12.09 | C18.1 v53.54,19.1 53.54,19.96 52.49,19.96 | U$2.63 52.49,19.96 | 52.49,19.96 C14.2 | U$2.88 40.89,25.93 v40.18,25.93 | C24.2 40.92,30.96 v39.67,30.96 | C28.1 19.96,7.36 C7.2 | R9.1 32.16,34.71 | 32.16,34.71 31.56,34.71 v31.19,35.08 | COMPASS.11 6.08,37.49 v6.1,37.57 | 7.43,37.45 v7.42,37.44 | MPU-6050.18 13.51,22.84 v12.6,22.84 11.12,22.84 C21.2 | C10.2 3.87,38.73 v3.45,38.84 | MPU-6050.1 13.51,18.51 | 13.77,18.77 13.77,19.03 MPU-6050.P 15.21,20.02 15.24,19.99 | MPU-6050.9 15.26,19.77 15.24,19.79 15.24,19.99 | 15.24,19.99 15.24,20.7 | 15.24,20.7 15.24,20.77 MPU-6050.11 | 13.87,21.21 14.73,21.21 15.24,20.7 | C20.2 C16.1 20,21.04 20.02,21.06 v21.29,21.06 | C17.1 21.29,18.31 v21.34,18.26 | U$3.VSS 59.11,25.76 v59.89,24.97 | R8.1 32.18,34.68 32.16,34.71 | C15.1 5.4,29.95 v5.84,29.74 | IC1.5 12.05,28.22 v12.5,28.22 13.84,28.22 C29.2 | IC1.1 10,24.66 v10.87,24.66 10.87,25.17 11.66,25.96 IC1.7
  Top 0.61: C2.2 63.07,4.85 v64.47,4.19
  Top 0.813: JP4.4 JP4.3 | JP4.6 JP4.5
  Bottom 0.254: v24.13,20.96 24.77,21.59 | v38.53,10.57 38.51,10.57 | v13.56,3.89 13.72,4.09 13.77,4.09
  Bottom 0.305: v30.05,12.09 30.05,12.06 | v53.54,19.1 53.62,19.1 | v40.18,25.93 40.18,25.83 40.08,25.83 | 39.42,31.01 v39.67,30.96 | v31.19,35.08 31.65,35.08 | v3.45,38.84 3.4,39.8 | v6.1,37.57 5.94,37.46 6.3,37.41 | v7.42,37.44 8.13,36.85 | v12.6,22.84 12.34,22.84 | v21.29,21.06 20.83,21.21 | v21.34,18.26 21.54,18.26 21.59,18.21 | v59.89,24.97 59.94,24.97 60.15,24.77 | v5.84,29.74 5.89,29.85 5.94,29.85 | v12.5,28.22 12.9,28.42 12.95,28.42 | v10.87,24.66 10.87,24.41 10.97,24.41
  Bottom 0.61: v64.47,4.19 65.68,4.04 65.13,4.14
  other vias: 27.44,6.32 32.42,6.32 31.03,6.32 41.26,6.32 48.26,6.35 52.77,6.35 50.91,6.35 14.61,8.26 16.51,8.26 28.65,19.74 57.8,6.4
  pour Bottom (isolate 0.305): -0.74,41.99 76,41.91 75.46,0.15 0,0.16
  pour Top (no thermals): 8.41,7.46 9.37,7.46 10.32,8.41 18.26,8.41 18.26,6.83 13.18,6.83 12.22,7.14 10,7.14 9.05,6.51 8.41,6.51
  pour Top (no thermals): 23.32,6.01 58.28,6.03 58.31,6.67 23.32,6.64
HX1EN  (via drill 0.3)
  Top 0.254: U$2.52 49.81,14.46 49.81,11.89 51.16,10.54 54,10.54 v54.28,10.82 | v57.56,10.82 57.56,15.52 67.82,15.52 U$4.EN
  Bottom 0.254: v54.28,10.82 v57.56,10.82
IND
  pour Top (no thermals): 10.79,6.51 10.79,1.75 9.53,1.75 9.53,5.24 10.16,6.51
LED0
  Top 0.254: U$2.9 34.44,21.96 34.44,26.04 33.02,27.46 33.02,28.54 LED0.A
LED1
  Top 0.254: U$2.10 35,21.46 35,26.24 33.83,27.41 33.83,28.83
  Top 0.305: 33.83,28.83 33.83,29.1 LED1.A
M1IN1
  Top 0.254: U3.10 24.59,9.78 32.66,9.78 32.66,13.96 U$2.25
M1IN2
  Top 0.254: U3.9 25.09,9.27 33.12,9.27 33.12,10.95 34.89,10.95 U$2.26
M2IN1
  Top 0.254: U3.8 25.6,8.76 33.02,8.71 33.58,8.71 33.58,10.49 35.39,10.49 U$2.27
M2IN2
  Top 0.254: U3.7 26.09,8.26 34.09,8.26 34.09,10.03 35.89,10.03 U$2.28
M3IN1
  Top 0.254: U$2.42 42.89,9.58 34.77,9.58 34.77,7.37 arc-90 U4.10
M3IN2
  Top 0.254: U$2.43 43.39,9.07 35.28,9.07 U4.9
M4IN1
  Top 0.254: U$2.44 43.89,8.51 35.79,8.51 U4.8
M4IN2
  Top 0.254: U$2.45 44.39,8.05 36.27,8.03 36.3,7.31 U4.7
M5IN1
  Top 0.254: U$2.46 44.91,11 U5.10
M5IN2
  Top 0.254: U$2.47 45.41,11 U5.9
M6IN1
  Top 0.254: U$2.48 45.92,11 U5.8
M6IN2
  Top 0.254: 46.43,7.37 U5.7 46.41,11 U$2.49
M7IN1
  Top 0.254: 55.09,8.51 U7.10 55.09,16.46 U$2.56
M7IN2
  Top 0.254: U$2.57 55.6,16.96 U7.9
M8IN1
  Top 0.254: U$2.58 56.11,17.46 U7.8
M8IN2
  Top 0.254: U$2.59 56.59,17.96 U7.7
M1234SLEEP  (via drill 0.3)
  Top 0.254: U$2.24 33.09,14.45 32.05,14.45 32.05,11 v31.95,10.49 32.11,10.29 24.16,10.29 arc90 24.08,10.19 U3.11 U3.12 | U4.12 v31.9,7.34
  Top 0.305: U4.11 U4.12
  Bottom 0.254: v31.9,7.34 31.9,10.34 arc-90 v31.95,10.49
M5678SLEEP  (via drill 0.3)
  Top 0.254: U$2.50 46.89,8.05 47.5,8.05 47.5,7.34 v47.55,7.34 47.55,8.05 54.1,8.05 U7.12 U7.11 | U5.11 U5.12 43.41,7.34 v42.93,7.34
  Bottom 0.254: v47.55,7.34 v42.93,7.34
N$2  (via drill 0.3)
  Top 0.254: U$1.5 12.33,6.38 v12.9,6.38 | v15.6,3.79 16.56,3.79 R3.1
  Bottom 0.254: v12.9,6.38 15.6,6.38 v15.6,3.79
N$4
  Top 0.254: GREEN.C 24.45,12.27 R4.2
N$5
  Top 0.254: LED0.C 32.41,32.8 R8.2
N$6
  Top 0.254: LED1.C R9.2
N$13
  Top 0.305: U4.2 34.27,4.47 30.45,4.12 SV2.1
N$14
  Top 0.254: U$2.86 41.89,37.57 40.23,37.57 38.66,38.63 DIGITAL2.1
N$15
  Top 0.254: U$2.85 42.39,38.79 41.1,38.79 41.15,39.75 DIGITAL2.2
N$17
  Top 0.203: COMPASS.10 6.63,36.61 6.63,37.31 6.81,37.69 6.81,38.71 C10.1
N$18
  Top 0.305: C16.2 18.28,20.27 MPU-6050.10
N$19
  Top 0.305: MPU-6050.20 11.15,20.77 C21.1
N$20
  Top 0.254: U$2.84 42.89,38.73 43.69,38.73 43.69,39.75 DIGITAL2.3
N$21
  Top 0.254: U$2.83 43.39,37.01 46.08,37.01 46.08,39.75 DIGITAL2.4
N$22
  Top 0.254: U$2.82 43.89,36.25 48.82,36.25 DIGITAL2.5
N$23
  Top 0.254: U$2.81 44.39,35.59 51.31,35.59 51.31,39.24 | 51.1,39.24 51.31,39.24 | 51.31,39.24 51.41,39.24 51.41,39.75 DIGITAL2.6
N$24
  Top 0.254: U$2.80 44.89,34.98 53.9,34.98 DIGITAL2.7
N$25
  Top 0.203: C13.2 8.46,36.44 COMPASS.8
N$26
  Top 0.254: U$2.79 45.39,34.27 56.44,34.27 DIGITAL2.8
N$27
  Top 0.305: U$2.97 36.39,39.75 ANALOG.8
N$28
  Top 0.305: U$2.98 35.89,37.57 34.59,37.57 33.55,38.61 ANALOG.7
N$30
  Top 0.305: U$2.99 35.39,36.91 33.48,36.91 31.01,39.37 ANALOG.6
N$31
  Top 0.254: U$2.78 45.89,33.5 58.52,33.5 58.52,39.65 58.98,39.65 DIGITAL2.9
N$32
  Top 0.203: C13.1 arc90 8.22,39.65 5.55,39.65 5.54,37.9 5.46,37.72 5.46,37.08 COMPASS.12
N$39
  Top 0.305: U4.3 34.77,4.37 34.62,4.06 32.99,3.2 SV2.2
N$40
  Top 0.305: SV2.3 35.33,2.34 U4.4
N$41
  Top 0.305: SV2.4 37.77,3.45 35.89,4.57 35.79,4.67 U4.5
N$42
  Top 0.254: U$1.6 13.6,9.24 C4.1
N$44
  Top 0.254: RED.C 12.87,1.2 R6.2
N$45
  Top 0.305: U5.2 44.4,4.55 42.22,4.29 40.39,3.38 SV3.1
N$46
  Top 0.305: U5.3 44.91,4.34 44.76,4.14 43.28,3.43 SV3.2
N$47
  Top 0.305: U5.4 SV3.3
N$48
  Top 0.305: U5.5 45.92,4.75 48.01,3.38 SV3.4
N$49
  Top 0.305: U3.2 24.08,4.57 22.89,4.52 | 22.89,4.52 21.64,4.27 SV1.1 | 22.89,4.52 19.96,3.86 21.59,4.27 19.56,3.05 21.18,3.86 20.37,3.05
N$50
  Top 0.305: U3.3 24.59,4.42 24.49,4.22 24.13,4.01 | 24.13,4.01 22.81,3.05 22.81,3.45 | 22.81,3.45 22.81,3.86 24.13,4.01 | 24.13,4.01 22.81,3.45 | 22.81,3.45 SV1.2
N$51
  Top 0.305: U3.4 25.09,4.67 | 25.09,4.67 25.09,3.45 24.84,3.45 25.04,4.06 | 25.04,4.06 25.25,4.27 | 25.25,4.27 25.09,4.67 | 25.09,4.67 25.65,3.45 25.25,3.45 25.25,4.27 | 25.09,4.67 25.04,4.06 | 25.04,4.06 SV1.3
N$52
  Top 0.305: U3.5 25.6,4.77 27.08,3.66 25.7,4.67 27.23,3.89 26.77,4.01 SV1.4
N$53
  Top 0.305: U7.2 54.59,4.6 52.6,4.32 51.03,3.63 SV4.1
N$54
  Top 0.305: U7.3 55.09,4.34 54.38,3.79 SV4.2
N$55
  Top 0.305: U7.4 SV4.3
N$56
  Top 0.305: U7.5 56.11,4.75 58.29,3.33 SV4.4
N$57
  Top 0.305: 22.35,4.42 19.76,3.1 19.56,3.45
N$58
  Top 0.305: 34.27,5.18 34.27,4.47 33.1,4.37 | 33.1,4.37 31.83,4.17 30.28,2.41 | 33.1,4.37 30.15,3.76 31.77,4.17 29.74,2.95 31.37,3.76 30.56,2.95
N$59
  Top 0.305: 34.77,5.18 34.77,4.32 34.67,4.12 34.31,3.91 | 34.31,3.91 32.99,2.95 32.99,3.35 | 32.99,3.35 32.99,3.76 34.31,3.91 | 34.31,3.91 32.99,3.35 | 32.99,3.35 32.82,2.41
N$60
  Top 0.305: 35.28,5.18 35.28,4.57 | 35.28,4.57 35.28,3.35 35.03,3.35 35.23,3.96 | 35.23,3.96 35.43,4.17 | 35.43,4.17 35.28,4.57 | 35.28,4.57 35.84,3.35 35.43,3.35 35.43,4.17 | 35.28,4.57 35.23,3.96 | 35.23,3.96 35.36,2.41
N$61
  Top 0.305: 35.79,5.18 35.79,4.67 37.26,3.56 35.89,4.57 37.87,3.76 36.96,3.91 37.9,2.41
N$62
  Top 0.305: 32.54,4.32 29.95,3 29.74,3.35
N$63
  Top 0.305: 44.4,5.26 44.4,4.55 43.23,4.45 | 43.23,4.45 41.96,4.24 40.41,2.49 | 43.23,4.45 40.28,3.83 41.91,4.24 39.88,3.02 41.5,3.83 40.69,3.02
N$64
  Top 0.305: 44.91,5.26 44.91,4.39 44.81,4.19 44.45,3.99 | 44.45,3.99 43.13,3.02 43.13,3.43 | 43.13,3.43 43.13,3.83 44.45,3.99 | 44.45,3.99 43.13,3.43 | 43.13,3.43 42.95,2.49
N$65
  Top 0.305: 45.41,5.26 45.41,4.65 | 45.41,4.65 45.41,3.43 45.16,3.43 45.36,4.04 | 45.36,4.04 45.57,4.24 | 45.57,4.24 45.41,4.65 | 45.41,4.65 45.97,3.43 45.57,3.43 45.57,4.24 | 45.41,4.65 45.36,4.04 | 45.36,4.04 45.49,2.49
N$66
  Top 0.305: 45.92,5.26 45.92,4.75 47.4,3.63 46.02,4.65 48.01,3.83 47.09,3.99 48.03,2.49
N$67
  Top 0.305: 42.67,4.39 40.08,3.07 39.88,3.43
N$68
  Top 0.305: 54.59,5.21 54.59,4.55 53.42,4.45 | 53.42,4.45 52.15,4.24 50.6,2.49 | 53.42,4.45 50.47,3.83 52.09,4.24 50.06,3.02 51.69,3.83 50.88,3.02
N$69
  Top 0.305: 55.09,5.26 55.09,4.39 54.99,4.19 54.63,3.99 | 54.63,3.99 53.31,3.02 53.31,3.43 | 53.31,3.43 53.31,3.83 54.63,3.99 | 54.63,3.99 53.31,3.43 | 53.31,3.43 53.14,2.49
N$70
  Top 0.305: 55.6,5.26 55.6,4.65 | 55.6,4.65 55.6,3.43 55.35,3.43 55.55,4.04 | 55.55,4.04 55.75,4.24 | 55.75,4.24 55.6,4.65 | 55.6,4.65 56.16,3.43 55.75,3.43 55.75,4.24 | 55.6,4.65 55.55,4.04 | 55.55,4.04 55.68,2.49
N$71
  Top 0.305: 56.11,5.26 56.11,4.75 57.58,3.63 56.21,4.65 58.19,3.83 57.28,3.99 58.22,2.49
N$72
  Top 0.305: 52.6,4.32 50.27,3.07 50.06,3.43
N$73
  Top 0.305: U$2.100 34.89,36.09 31.19,36.09 28.55,38.73 28.55,39.67 ANALOG.5
N$74
  Top 0.254: U$2.1 32.51,25.96 32.51,27.2 31.5,28.22 31.5,31.78 25.93,37.34 ANALOG.4
N$75
  Top 0.254: U$2.2 32,25.46 32,26.65 30.94,27.71 30.94,31.42 23.88,38.48 23.88,39.27 ANALOG.3
N$76
  Top 0.254: U$2.3 31.5,24.96 31.5,26.19 30.28,27.41 30.28,30.33 ANALOG.2
N$77
  Top 0.254: U$2.4 31.01,24.46 31.01,25.65 29.16,27.51 29.16,29.79 21.84,37.06 20.22,37.06 18.24,39.04 18.24,39.67 ANALOG.1 18.34,39.73 18.29,40.56
N$78
  Top 0.254: U$2.77 46.39,32.23 63.5,32.23 63.5,37.26 61.87,38.73 61.87,39.39 DIGITAL2.10
N$79
  Top 0.254: U$2.76 46.89,31.67 64.06,31.67 DIGITAL2.11
P5.4/XIN1
  Top 0.254: U$2.13 30.38,19.96 Q2.P2 29.96,20.38 C22.2
P5.5/XOUT1
  Top 0.254: U$2.14 30.38,19.46 Q2.P1 29.96,19.04 C9.2
RFGND
  Bottom 0.61: SJ2.2 8.99,13.54 19.71,13.59 26.67,13.03 33.83,13.03 34.8,11.94 37.39,8.51 50.49,8.51 51.26,7.75 58.22,7.75 59.18,4.65 71.22,4.6 71.22,33.45 | 71.22,33.45 71.27,37.87 71.27,38.53 U$4.RFGND | U$4.RFGND2 71.22,33.45
RST
  Top 0.254: U$2.96 36.89,35.74 JP1.1
RX
  Top 0.305: U$2.54 51.92,15.46 JP2.1
SCL  (via drill 0.3)
  Top 0.254: U$2.35 39.39,15.24 v34.92,15.24
  Top 0.305: 4.95,25.04 RPUD.1 3.54,31.52 COMPASS.1 | 4.95,25.04 6.3,23.69 6.3,20.7 4.98,19.38 JP5.4 4.98,16.68 5.21,16.68 JP4.2 11.68,16.67 | v26.06,16.23 11.84,16.23 11.68,16.38 11.68,16.67 | MPU-6050.23 11.68,19.27 11.68,16.67 | IC1.4 7.17,27.26 4.95,25.04
  Bottom 0.254: v34.92,15.24 34.92,16.18 v26.06,16.23
SDA  (via drill 0.3)
  Top 0.254: U$2.34 38.89,13.97 v34.92,13.97 | v24.77,15.24 v12.7,15.24 12.83,15.34 | RPUC.1 2.69,24.96 2.69,27.76
  Top 0.305: MPU-6050.24 12.78,16.94 v12.62,16.94 | 12.83,15.34 8.26,15.37 3.76,15.37 JP4.1 2.36,16.73 2.44,16.73 JP5.3 3.71,20.5 3.71,23.94 RPUC.1 arc90 3.75,23.9 v4.98,23.9 | 2.69,27.76 2.69,32.17 COMPASS.16 | IC1.3 8,26.61 v6.45,25.07
  Bottom 0.254: v34.92,13.97 28.57,13.97 28.57,15.24 v24.77,15.24 | v12.62,16.94 12.7,16.94 v12.7,15.24
  Bottom 0.305: v6.45,25.07 5.28,23.9 v4.98,23.9
SPI_EXTSLAVE_TE
  Top 0.254: U$2.71 53.54,23.96 54.41,22.48 JP3.2
SPI_FLASH_CS
  Top 0.305: 62.92,29.85 62.92,30 R16.1 | U$3.CE 62.92,29.85 | 62.92,29.85 53.09,29.85 53.09,25.96 U$2.75
SPI_MISO
  Top 0.254: U$2.73 53.59,24.96 53.59,27.56 JP3.4
  Top 0.305: JP3.4 58.06,27.56 58.06,28.98 61.62,28.98 61.62,27.12 U$3.SO
SPI_MOSI
  Top 0.254: U$2.72 54.97,24.46 54.97,25.02 JP3.3
  Top 0.305: U$3.SI 59.11,24.41 56.24,24.41 56.24,25.02 JP3.3
SPI_SCK
  Top 0.254: U$2.68 53.65,22.46 53.65,20.9 55.78,20.9 JP3.1 57.66,19.94 57.66,17.2 60.38,17.2 U$3.SCK
TST
  Top 0.305: U$2.91 39.39,29.13 38.66,29.13 38.66,33.2 JP1.2
TX
  Top 0.305: U$2.53 50.03,14.96 50.42,14.58 50.42,12.24 JP2.2
  Bottom 0.406: JP2.2 64.57,12.24 64.57,10.95 66.6,8.91 U$4.TXD
V_MOTOR  (via drill 0.3)
  Top 0.254: U7.1 54.1,5.4 51.82,5.4 v51.82,5.38 50.93,5.38 50.93,4.97 C8.2 | C28.2 22.08,6.96 | v32.74,5.02 32.74,4.97 C27.2 | v42.86,5.4 arc-90 v42.85,5.38 40.92,5.38 40.92,4.97 C26.2
  Top 0.305: U4.1 33.78,5.37 v32.74,5.02 | U5.1 43.92,5.4 v42.86,5.4 | C28.2 22.05,6.9 22.05,5.97 22.05,5.41 v22.17,5.28 U3.1
  Bottom 0.254: v51.82,5.38 50.93,5.38 50.93,4.77 49.21,4.77 49.21,4.76
  Bottom 0.305: 21.97,5.32 22.36,4.74 | v32.74,5.02 32.61,4.74 32.93,4.74 | v42.86,5.4 42.86,4.76 | SJ1.2 22.17,6.83 v22.17,5.28
  Bottom 0.61: SJ1.2 22.05,4.74 22.36,4.74 32.93,4.74 42.86,4.76 49.21,4.76
VCORE
  Top 0.305: U$2.62 50.42,19.46 arc-90 C18.2

### Text on the board
tValues: HMC5883L | Octanis 1 v0.3 | octanis.org | SCL | GND | 5V |GND| 3.3V | GND | SDA | 3.3V